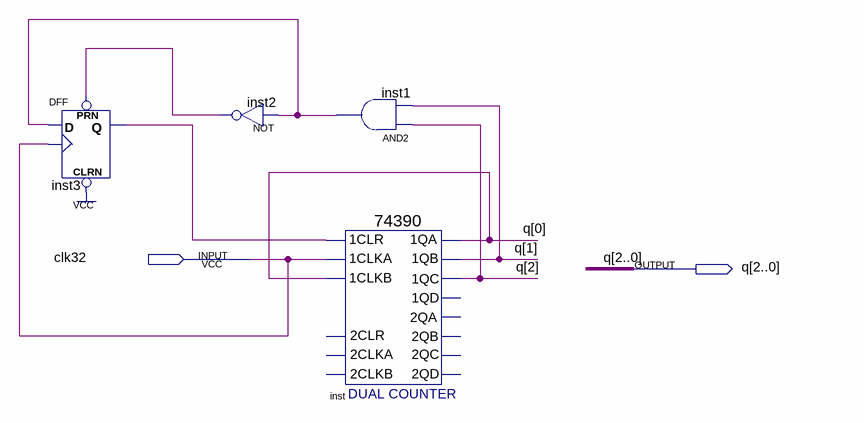
[diagram p0: schematic sheet]
// Quartus schematic jjncnt1.bdf as structural Verilog: 4 symbols, 2 pins
module jjncnt1 (
  input  clk32,
  output [2:0] q
);

  wire inst1_out, inst2_out, inst3_q;

  DFF inst3 (.CLRN(1'b1), .CLK(clk32), .D(inst1_out), .PRN(inst2_out), .Q(inst3_q));
  not inst2 (inst2_out, inst1_out);
  and inst1 (inst1_out, q[2], q[1]);
  \74390  inst (
    .\1CLR (inst3_q), .\1CLKA (clk32), .\1CLKB (q[0]), .\1QA (q[0]), .\1QB (q[1]), .\1QC (q[2]));  // open: 2CLKA, 2CLR, 2CLKB, 1QD, 2QA, 2QB, 2QC, 2QD
endmodule
